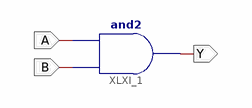
[diagram p0: schematic sheet 1]
// Xilinx ISE schematic simpleand.sch (spartan3e) as structural Verilog: 1 symbols, 3 ports
module simpleand (
  input  A,
  input  B,
  output Y
);

  and XLXI_1 (Y, B, A);
endmodule
